# Altium schematic sheet INDEX.SchDoc
size 420 x 297 mm; SheetNumber: 1; SheetTotal: 5
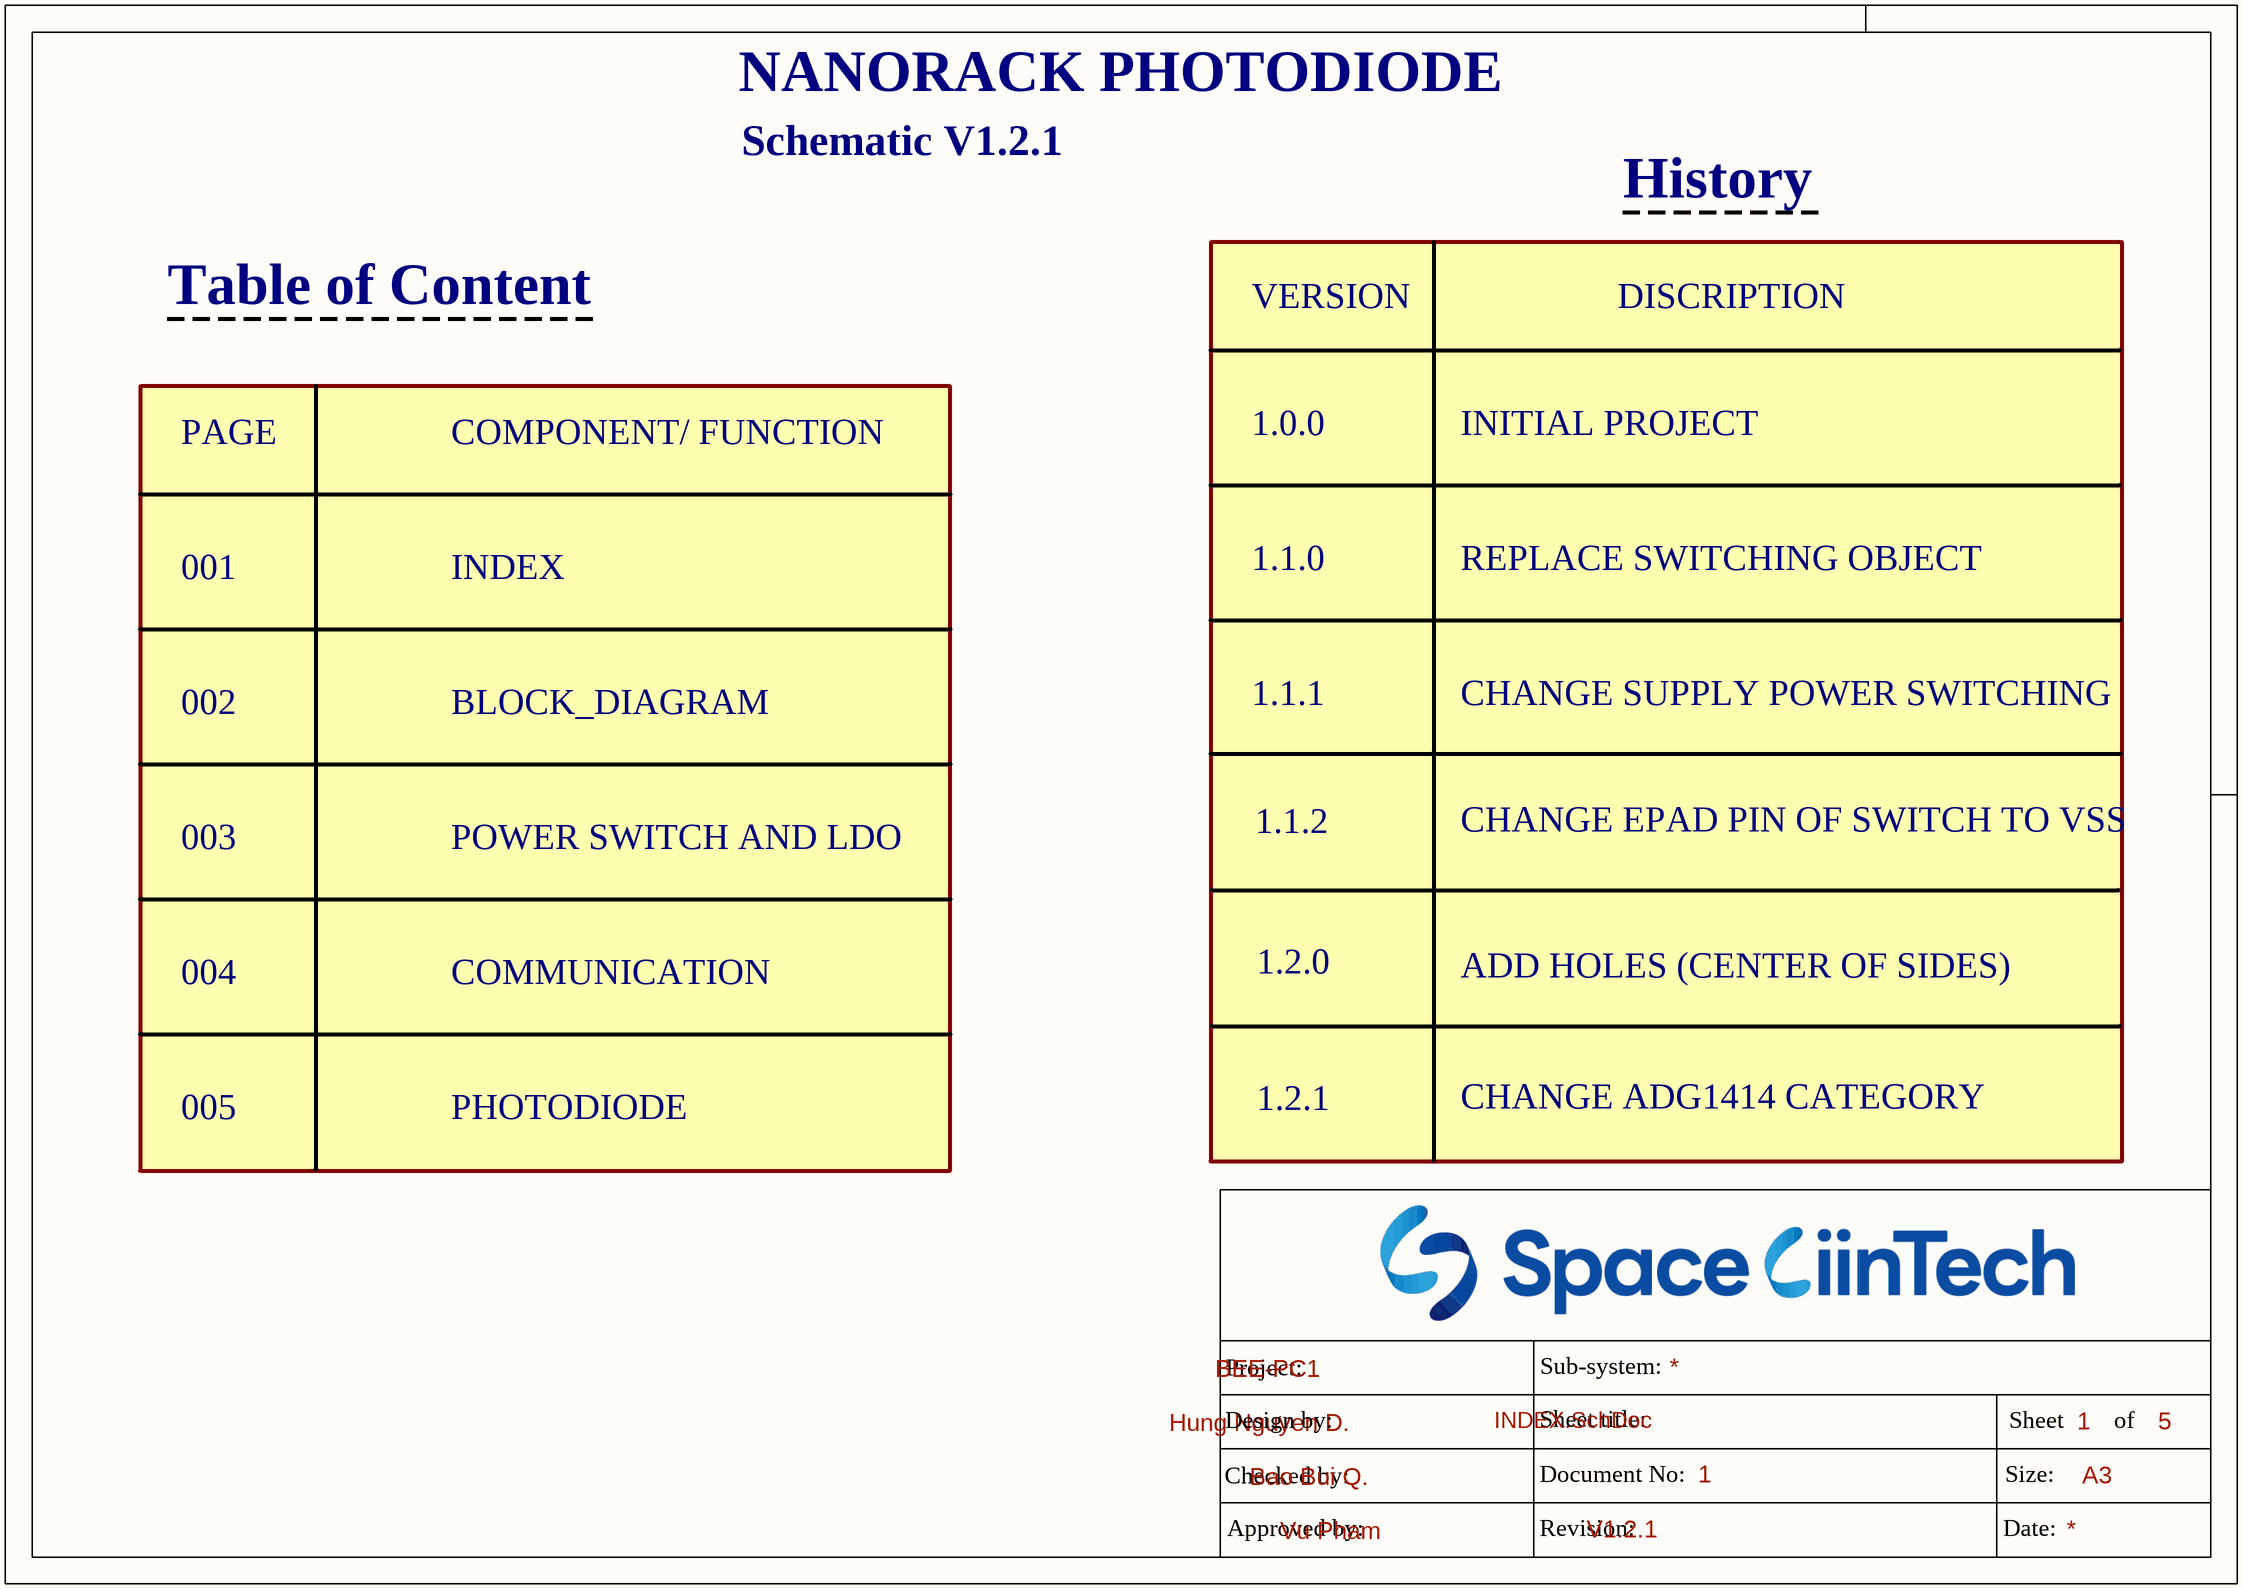
[diagram p0: INDEX.SchDoc]

## Notes on the sheet
- NANORACK PHOTODIODE
- Schematic V1.2.1
- History
- Table of Content
- VERSION
- DISCRIPTION
- PAGE
- COMPONENT/ FUNCTION
- 1.0.0
- INITIAL PROJECT
- 001
- INDEX
- 1.1.0
- REPLACE SWITCHING OBJECT
- 002
- BLOCK_DIAGRAM
- 1.1.1
- CHANGE SUPPLY POWER SWITCHING
- 003
- POWER SWITCH AND LDO
- 1.1.2
- CHANGE EPAD PIN OF SWITCH TO VSS
- 004
- COMMUNICATION
- 1.2.0
- ADD HOLES (CENTER OF SIDES)
- 005
- PHOTODIODE
- 1.2.1
- CHANGE ADG1414 CATEGORY
- Project:
- BEE-PC1
- Sub-system:
- Design by:
- Hung Nguyen D.
- Bao Bui Q.
- Sheet title:
- Sheet
- A3
- of
- Checked by:
- Approved by:
- Vu Pham
- Revision:
- Document No:
- V1.2.1
- Size:
- Date: